# EasyEDA schematic SCH_VCNL4010_2023-08-02.json
TITLE: Sheet_1; REV: 1.0; Date: 2023-03-03; Sheet: 1/1; Drawn By: Ted Langhorst; Company: Your Company
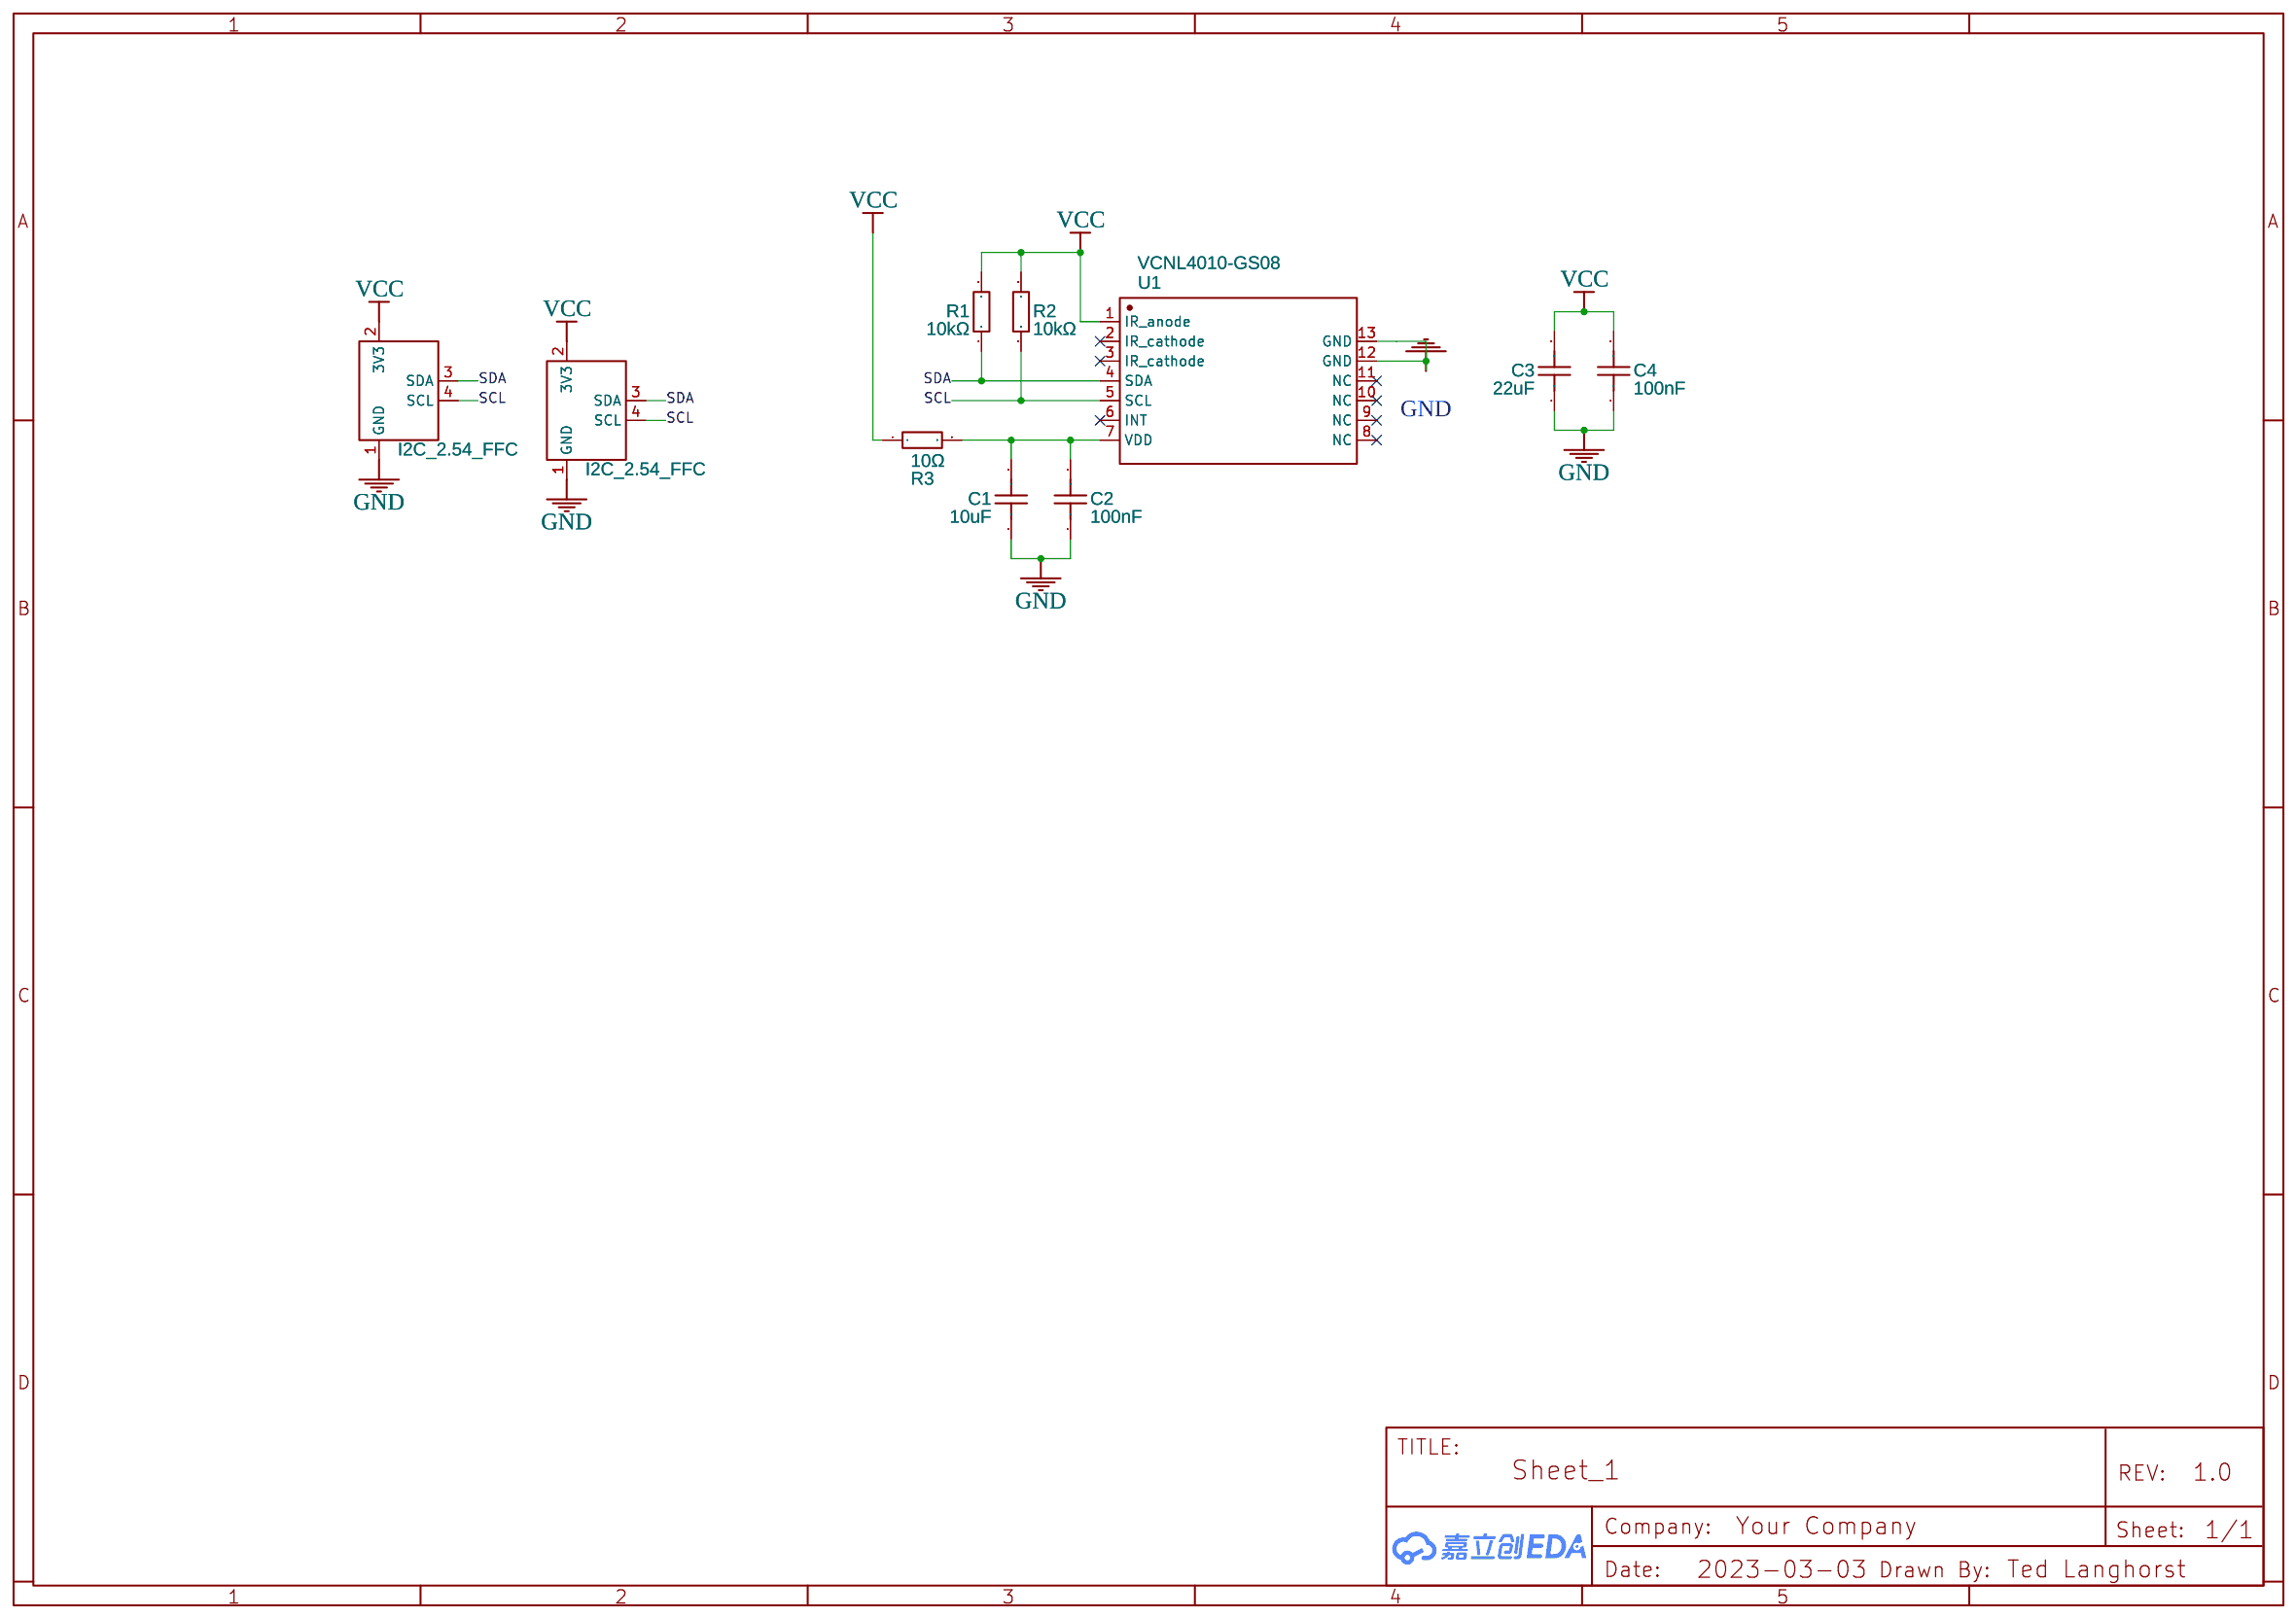
[diagram p0: schematic sheet]

## Parts
C1  10uF  [C0603]
C2  100nF  [C0603]
C3  22uF  [C0603]
C4  100nF  [C0603]
R1  10kΩ  [R0603]
R2  10kΩ  [R0603]
R3  10Ω  [R0603]
U1  VCNL4010-GS08  [SENSORS-SMD_VCNL4010-GS08]
U2  I2C_2.54_FFC  [1X4_2.54_FLATFLEX]
U3  I2C_2.54_FFC  [1X4_2.54_FLATFLEX]

## Library data of the parts
C1 = CL10A106MA8NRNC: Supplier: LCSC; Manufacturer: SAMSUNG(三星); Supplier Part: C96446; JLCPCB Part Class: Basic Part
C2 C4 = CC0603KRX7R9BB104: Supplier: LCSC; Manufacturer: YAGEO(国巨); Supplier Part: C14663; JLCPCB Part Class: Basic Part
C3 = CL10A226MQ8NRNC: Supplier: LCSC; Manufacturer: SAMSUNG(三星); Supplier Part: C59461; JLCPCB Part Class: Basic Part
R1 R2 = 0603WAF1002T5E: Supplier: LCSC; Manufacturer: UNI-ROYAL(厚声); Supplier Part: C25804; Resistance (Ohms): 10K; JLCPCB Part Class: Basic Part
R3 = 0603WAF100JT5E: Supplier: LCSC; Manufacturer: UNI-ROYAL(厚声); Supplier Part: C22859; JLCPCB Part Class: Basic Part
U1 = VCNL4010-GS08: Supplier: LCSC; Manufacturer: VISHAY(威世); Contributor: LCSC; Supplier Part: C92131; JLCPCB Part Class: Extended Part
U2 U3 = I2C_2.54_FFC: Manufacturer: TE Connectivity AMP Connectors; Manufacturer Part: 5-1474644-0; Supplier: Digi-Key; Supplier Part: A128864-ND; link: https://www.digikey.com/en/products/detail/te-connectivity-amp-connectors/5-1474644-0/5400035; Contributor: ted.langhorst

## Nets
GND: C1.1 C2.1 C3.1 C4.1 U1.12(GND) U1.13(GND) U2.1(GND) U3.1(GND)
VCC: C3.2 C4.2 R1.2 R2.2 R3.1 U1.1(IR_anode) U2.2(3V3) U3.2(3V3)
SCL: R2.1 U1.5(SCL) U2.4(SCL) U3.4(SCL)
SDA: R1.1 U1.4(SDA) U2.3(SDA) U3.3(SDA)
Net-(C1-2): C1.2 C2.2 R3.2 U1.7(VDD)

Not connected (* = marked no-connect by the designer): U1 2(IR_cathode)* 3(IR_cathode)* 6(INT)* 8(NC)* 9(NC)* 10(NC)* 11(NC)*
